# Altium schematic sheet Elekid_04.SchDoc
size A4
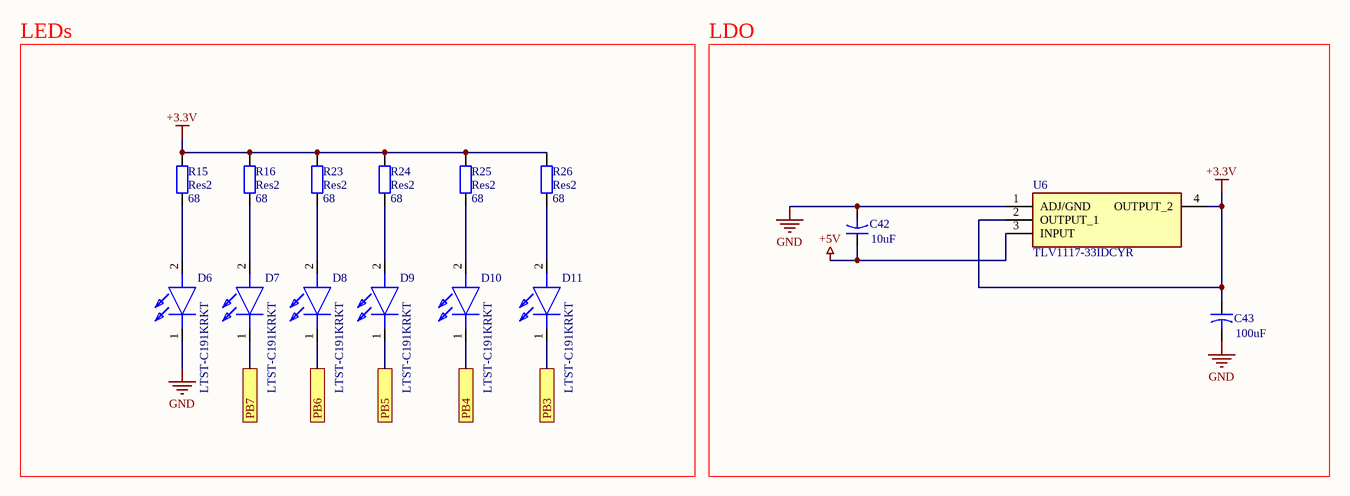
[diagram p0: Elekid_04.SchDoc]

## Parts
C42  value 10uF  [C0805]  (hidden comment: Cap2)
C43  value 100uF  [C0805]  (hidden comment: Cap2)
D6  LTST-C191KRKT  [LEDC1608X55N]
D7  LTST-C191KRKT  [LEDC1608X55N]
D8  LTST-C191KRKT  [LEDC1608X55N]
D9  LTST-C191KRKT  [LEDC1608X55N]
D10  LTST-C191KRKT  [LEDC1608X55N]
D11  LTST-C191KRKT  [LEDC1608X55N]
R15  Res2  value 68  [C0805]
R16  Res2  value 68  [C0805]
R23  Res2  value 68  [C0805]
R24  Res2  value 68  [C0805]
R25  Res2  value 68  [C0805]
R26  Res2  value 68  [C0805]
U6  TLV1117-33IDCYR  [SOT230P700X180-4N]

## Blocks framed on the sheet
LEDs: D6-D11 R15 R16 R23-R26
LDO: C42 C43 U6

## Ports
PB3, PB4, PB5, PB6, PB7

## Nets
+3.3V: C43.1 R15.2 R16.2 R23.2 R24.2 R25.2 R26.2 U6.2(OUTPUT_1) U6.4(OUTPUT_2)
+5V: C42.1 U6.3(INPUT)
GND: C42.2 C43.2 D6.1(K) U6.1(ADJ/GND)
PB3: D11.1(K) ; port PB3
PB4: D10.1(K) ; port PB4
PB5: D9.1(K) ; port PB5
PB6: D8.1(K) ; port PB6
PB7: D7.1(K) ; port PB7
NetD6_2: D6.2(A) R15.1
NetD7_2: D7.2(A) R16.1
NetD8_2: D8.2(A) R23.1
NetD9_2: D9.2(A) R24.1
NetD10_2: D10.2(A) R25.1
NetD11_2: D11.2(A) R26.1

## Library data of the parts
C42 C43 = Cap2: Capacitor; Published: 23-Sep-2002; PackageReference: CAPR5-4X5; Publisher: Altium Limited; PackageDescription: Capacitor; 2 Leads
D6-D11 = LTST-C191KRKT: LED; Manufacturer_Name: Lite-On; Datasheet Link: http://www.mouser.com/ds/2/239/S_110_LTST-C191KRKT-539838.pdf; Height: 0.55mm; Manufacturer_Part_Number: LTST-C191KRKT; Arrow Part Number: LTST-C191KRKT; Arrow Price/Stock: https://www.arrow.com/en/products/ltst-c191krkt/lite-on-technology; Mouser Part Number: 859-LTST-C191KRKT; Mouser Price/Stock: https://www.mouser.co.uk/ProductDetail/Lite-On/LTST-C191KRKT?qs=BAIUz4Y8PJBLfOhzue0q%252BA%3D%3D
R15 R16 R23-R26 = Res2: Resistor; Published: 8-Jun-2000; LatestRevisionDate: 17-Jul-2002; LatestRevisionNote: Re-released for DXP Platform.; PackageReference: AXIAL-0.4; Publisher: Altium Limited; PackageDescription: Axial Device, Thru-Hole; 2 Leads; 0.4 in Pin Spacing
U6 = TLV1117-33CDCYR: Integrated Circuit; Manufacturer_Name: Texas Instruments; Datasheet Link: http://www.ti.com/lit/gpn/tlv1117; Height: 1.8mm; Manufacturer_Part_Number: TLV1117-33CDCYR; Arrow Part Number: TLV1117-33CDCYR; Arrow Price/Stock: https://www.arrow.com/en/products/tlv1117-33cdcyr/texas-instruments; Mouser Part Number: 595-TLV1117-33CDCYR; Mouser Price/Stock: https://www.mouser.co.uk/ProductDetail/Texas-Instruments/TLV1117-33CDCYR?qs=p6lVfQR1GSoiRKz8KGIbKg%3D%3D